# EAGLE schematic lcd screen schematic (EAGLE 9.2.0)
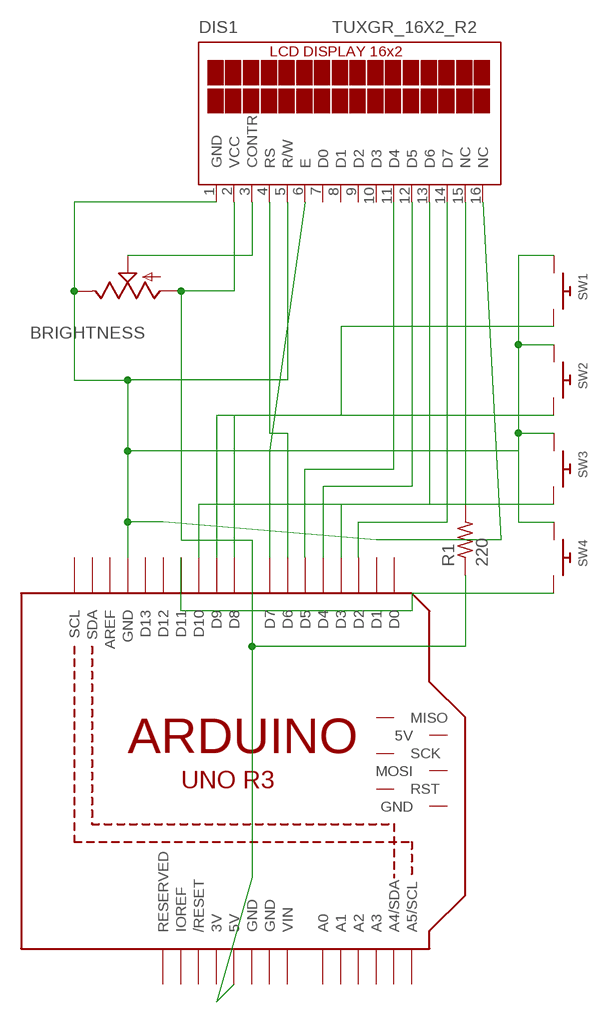
[diagram p0: schematic, sheet 1]

## Parts
BRIGHTNESS  TRIM_US-S75P  [S75P]
DIS1  TUXGR_16X2_R2  [TUXGR_16X2_R2]
M1  ARDUINO_R3_ICSP_NODIM  [ARDUINOR3_ICSP_NODIM]
R1  220  R-US_0204/2V  [0204V]
SW1  SWITCH_PUSHBUTTONSOFTTOUCHSMD_SJ  [PUSHBUTTON_SMD_SJ]
SW2  SWITCH_PUSHBUTTONSOFTTOUCHSMD_SJ  [PUSHBUTTON_SMD_SJ]
SW3  SWITCH_PUSHBUTTONSOFTTOUCHSMD_SJ  [PUSHBUTTON_SMD_SJ]
SW4  SWITCH_PUSHBUTTONSOFTTOUCHSMD_SJ  [PUSHBUTTON_SMD_SJ]

## Nets
N$1: DIS1.12(D5) M1.D4
N$2: BRIGHTNESS.E DIS1.1(GND) DIS1.5(R/W) DIS1.16(NC) M1.GND SW1.P$1 SW2.P$1 SW3.P$1 SW4.P$1
N$3: DIS1.15(NC) R1.2
N$4: DIS1.14(D7) M1.D2
N$6: DIS1.13(D6) M1.D3
N$7: DIS1.11(D4) M1.D5
N$8: DIS1.6(E) M1.D7
N$9: BRIGHTNESS.A DIS1.2(VCC) M1.5V R1.1
N$10: DIS1.4(RS) M1.D6
N$11: BRIGHTNESS.S DIS1.3(CONTR)
N$12: M1.D8 SW1.P$2
N$13: M1.D9 SW2.P$2
N$14: M1.D10 SW3.P$2
N$15: M1.D11 SW4.P$2
Unconnected: DIS1.7(D0) DIS1.8(D1) DIS1.9(D2) DIS1.10(D3) M1.5V_ICSP(5V) M1.A0 M1.A1 M1.A2 M1.A3 M1.A4(A4/SDA) M1.A5(A5/SCL) M1.AREF M1.D0 M1.D1 M1.D12 M1.D13 M1.GND@2(GND) M1.IOREF M1.MISO M1.MOSI M1.RESERVED M1.RESET(/RESET) M1.RESET_ICSP(RST) M1.SCK M1.SCL M1.SDA

## Power pins joined to a net without a drawn wire
3V: M1.3V
GND: M1.GND@1(GND) M1.GND@3(GND)
VIN: M1.VIN

## Library data of the parts
BRIGHTNESS = pot:TRIM_US-: POTENTIOMETER
DIS1 = display-lcd:TUXGR_16X2_R2: Tuxgraphics LCD display 16x2 characters reflective, without background light Source: tuxgr_12x2_r2.pdf; OC_FARNELL: unknown; OC_NEWARK: unknown
M1 = adafruit:ARDUINO_R3_ICSP
R1 = resistor:R-US_: RESISTOR, American symbol
SW1-SW4 = adafruit:SWITCH_PUSHBUTTON: Buttons SOFTTOUCHSMD_SJ - Soft touch temporary push button (Super Junk Akihabara) Compatible with SKPMANE010 [Mouser: 688-SKPMAN] C&K_KSS = Digikey: KSS221GLFS